# EAGLE design Top Falcon (EAGLE 9.6.2)
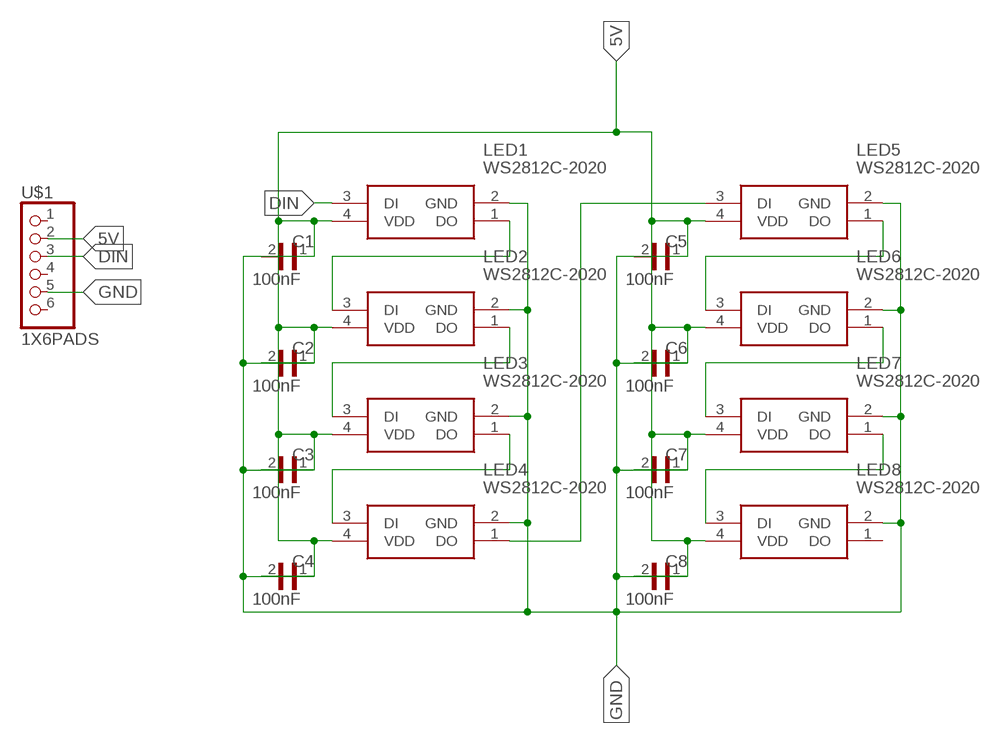
[diagram p0: schematic, sheet 1]

## Parts
C1  100nF  CC0402KRX7R5BB104  [CAPC1005X55N]
C2  100nF  CC0402KRX7R5BB104  [CAPC1005X55N]
C3  100nF  CC0402KRX7R5BB104  [CAPC1005X55N]
C4  100nF  CC0402KRX7R5BB104  [CAPC1005X55N]
C5  100nF  CC0402KRX7R5BB104  [CAPC1005X55N]
C6  100nF  CC0402KRX7R5BB104  [CAPC1005X55N]
C7  100nF  CC0402KRX7R5BB104  [CAPC1005X55N]
C8  100nF  CC0402KRX7R5BB104  [CAPC1005X55N]
LED1  WS2812C-2020  [WS2812C2020]
LED2  WS2812C-2020  [WS2812C2020]
LED3  WS2812C-2020  [WS2812C2020]
LED4  WS2812C-2020  [WS2812C2020]
LED5  WS2812C-2020  [WS2812C2020]
LED6  WS2812C-2020  [WS2812C2020]
LED7  WS2812C-2020  [WS2812C2020]
LED8  WS2812C-2020  [WS2812C2020]
U$1  1X6PADS  [1X6PADS]

## Nets
5V: C1.2 C2.2 C3.2 C4.2 C5.2 C6.2 C7.2 C8.2 LED1.4(VDD) LED2.4(VDD) LED3.4(VDD) LED4.4(VDD) LED5.4(VDD) LED6.4(VDD) LED7.4(VDD) LED8.4(VDD) U$1.2
DIN: LED1.3(DI) U$1.3
GND: C1.1 C2.1 C3.1 C4.1 C5.1 C6.1 C7.1 C8.1 LED1.2(GND) LED2.2(GND) LED3.2(GND) LED4.2(GND) LED5.2(GND) LED6.2(GND) LED7.2(GND) LED8.2(GND) U$1.5
N$1: LED1.1(DO) LED2.3(DI)
N$2: LED2.1(DO) LED3.3(DI)
N$3: LED3.1(DO) LED4.3(DI)
N$4: LED4.1(DO) LED5.3(DI)
N$5: LED5.1(DO) LED6.3(DI)
N$6: LED6.1(DO) LED7.3(DI)
N$7: LED7.1(DO) LED8.3(DI)
Unconnected: LED8.1(DO) U$1.1 U$1.4 U$1.6

## Library data of the parts
C1-C8 = CC0402KRX7R5BB104:CC0402KRX7R5BB104: CAP CER 0.1UF 6.3V X7R 0402; DESCRIPTION: 0.1µF ±10% 6.3V Ceramic Capacitor X7R 0402 (1005 Metric); DIGI-KEY_PART_NUMBER: 311-1701-1-ND; MF: Yageo; MP: CC0402KRX7R5BB104; PACKAGE: 0402 Yageo
LED1-LED8 = WS2812C-2020:WS2812C-2020: Intelligent control LED integrated light source Source: Datasheet <http://www.world-semi.com/DownLoadFile/139>; ARROW_PART_NUMBER: WS2812C-2020; DESCRIPTION: Intelligent control LED integrated light source; HEIGHT: 0.84mm; MANUFACTURER_NAME: Worldsemi; MANUFACTURER_PART_NUMBER: WS2812C-2020
U$1 = SMD Pads:1X6PADS

## Board
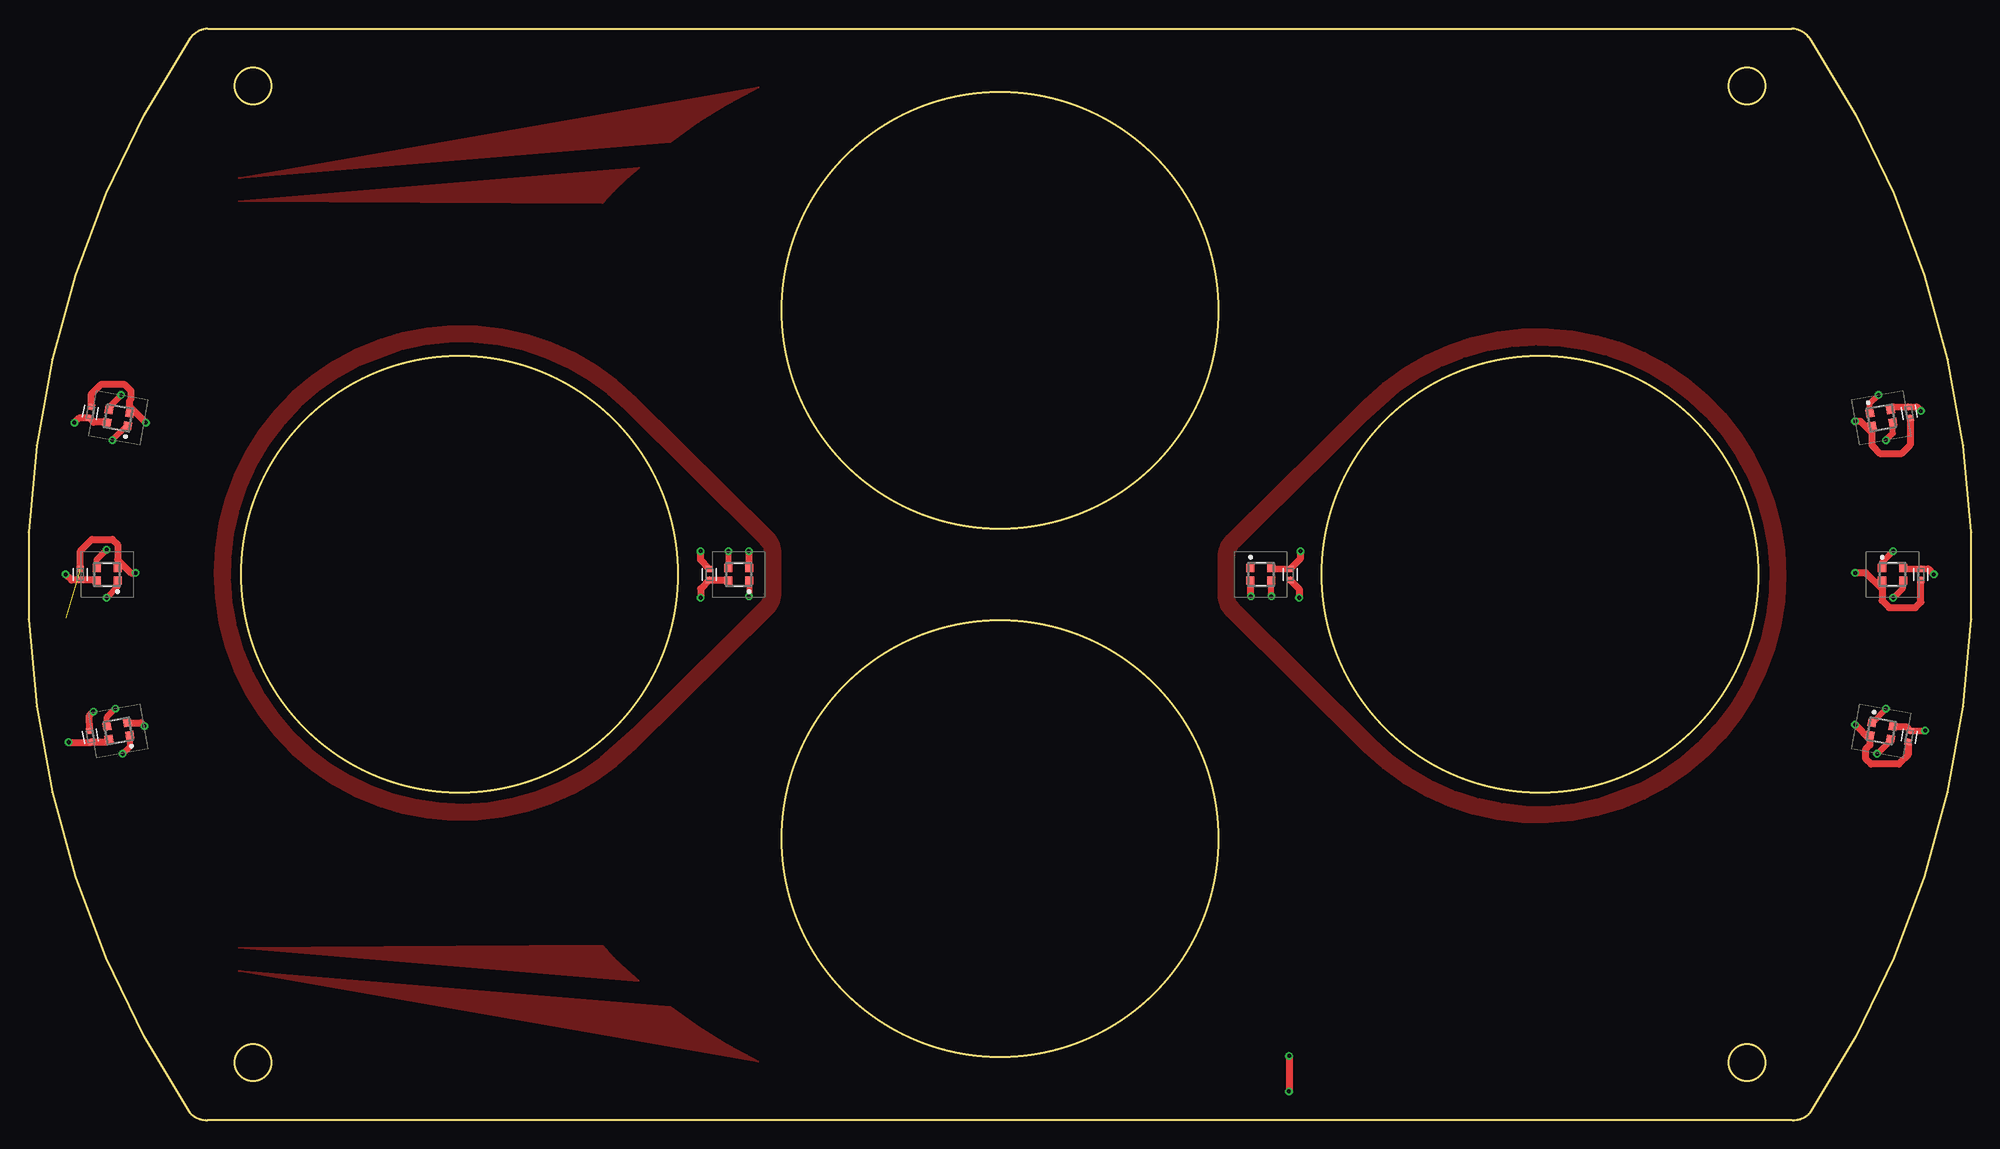
[diagram p1: board, top side]
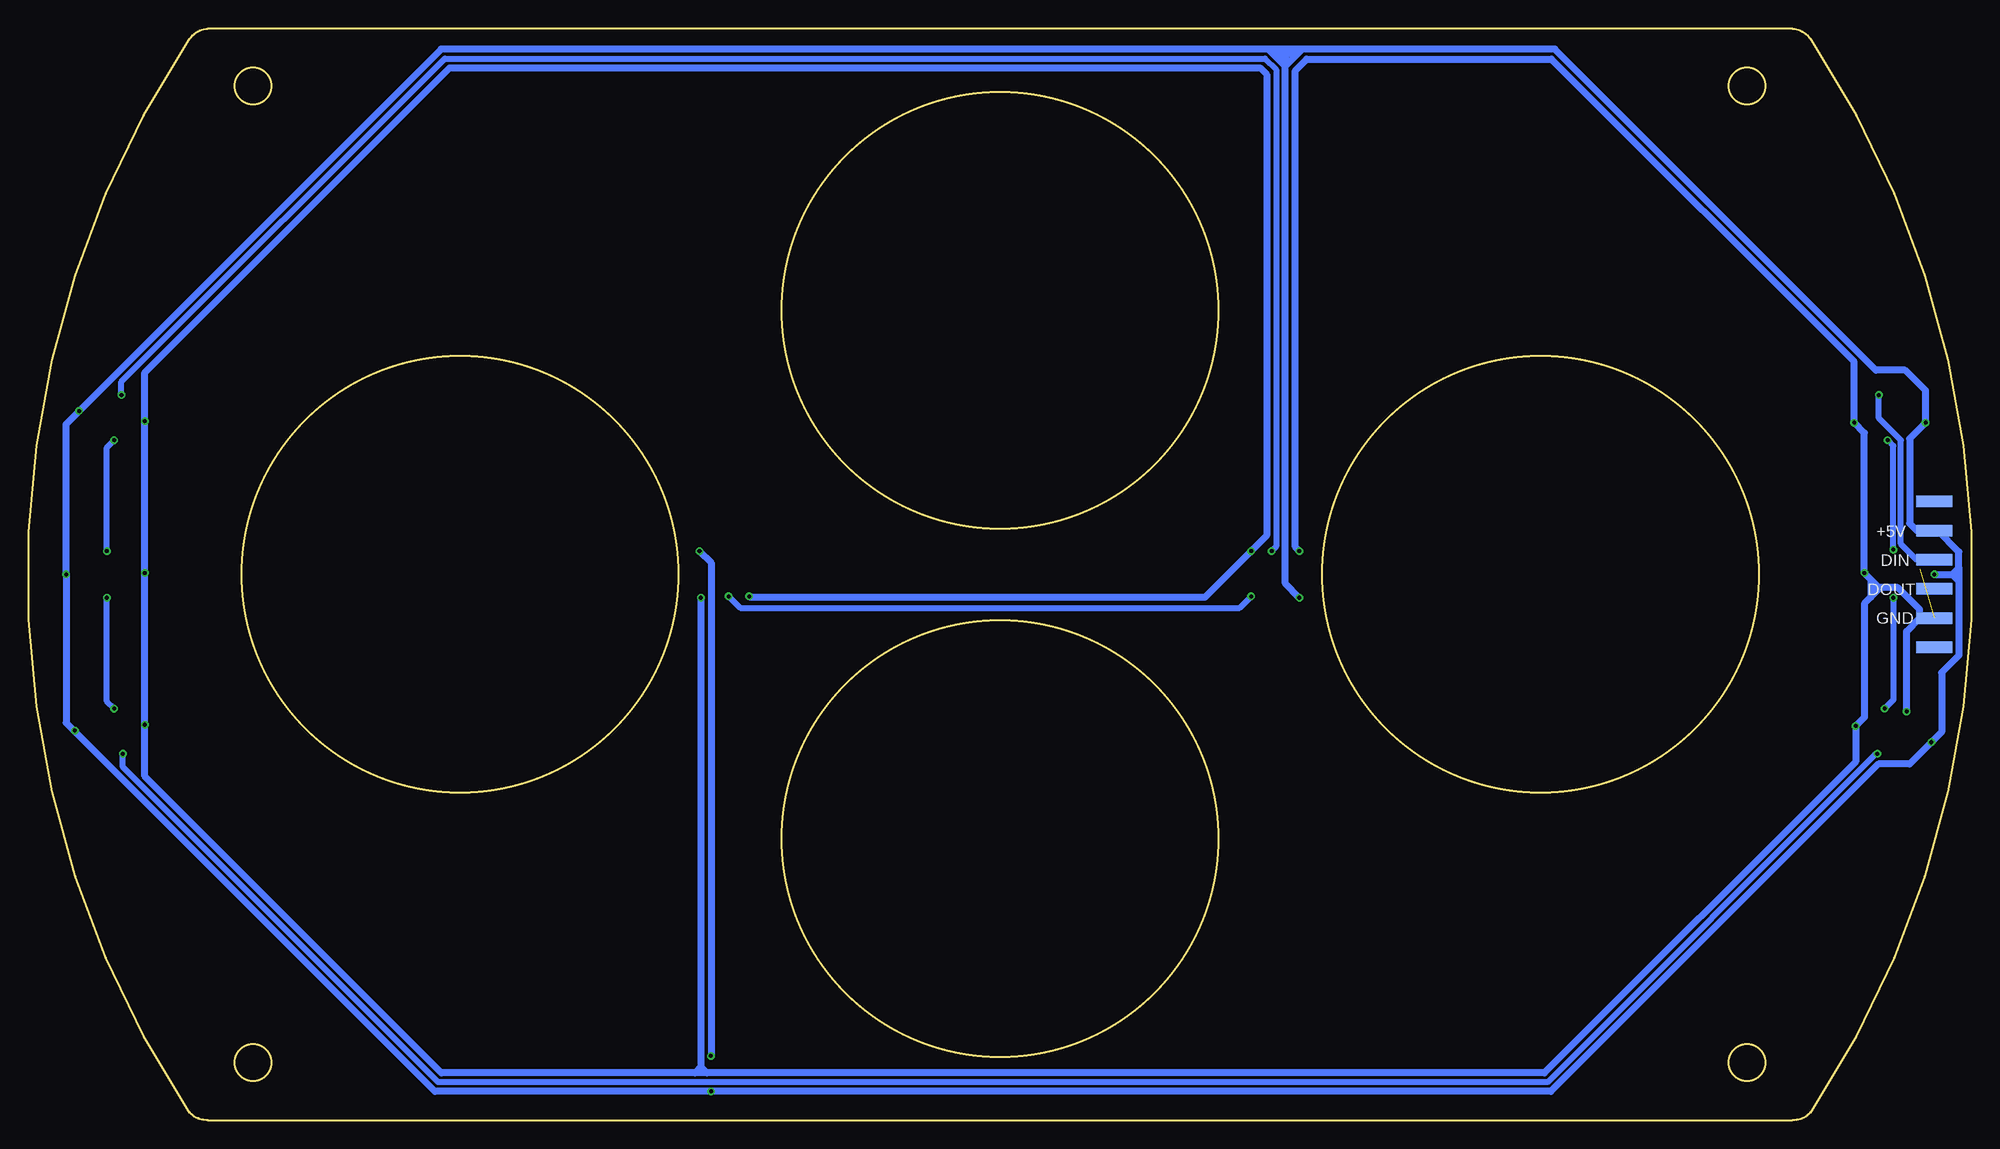
[diagram p2: board, bottom side, seen from below]

Size 169.02 x 95 mm. Coordinates in mm from the lower left corner, seen from the top.
Outline: 15.56,95 153.42,95 arc-57 155.11,93.98 arc-67 155.11,0.78 arc-57 153.42,0 15.56,0 arc-57 13.91,0.78 arc-67 13.91,93.98 arc-57 15.56,95
Outline: circle at 131.49,47.5 radius 19
Outline: circle at 84.49,70.5 radius 19
Outline: circle at 84.49,24.5 radius 19
Outline: circle at 37.49,47.5 radius 19
Outline: circle at 149.49,90 radius 1.6
Outline: circle at 19.49,90 radius 1.6
Outline: circle at 149.49,5 radius 1.6
Outline: circle at 19.49,5 radius 1.6
Copper layers (1*16): Top 0.035mm / dielectric 1.5mm / Bottom 0.035mm
Design rules "default *": minimum track width 5mil, minimum drill 0.3mm, track to track 5mil, track to pad 0.229mm, pad to pad 0.229mm, via to via 0.229mm, smd to smd 5mil, copper to edge 0.5mm, drill to drill 0.5mm, minimum pad ring 0.15mm, minimum via ring 0.15mm, stop-mask expansion 4mil, vias tented up to drill 0.35mm, thermal gap 10mil

### Footprints (pad centres in the part's own frame; a part is rotated, then mirrored left to right if it is on the bottom)
CAPC1005X55N = smd 0.527 x 0.6: 1 -0.486,0; 2 0.486,0
WS2812C2020 = smd 0.7 x 0.7: 1 0.915,-0.55; 2 0.915,0.55; 3 -0.915,0.55; 4 -0.915,-0.55
1X6PADS = smd 3.135 x 1: 1 0,6.35; 2 0,3.81; 3 0,1.27; 4 0,-1.27; 5 0,-3.81; 6 0,-6.35

### Placement (x,y rotation side)
C1  5.37,61.6 260 top
C2  4.48,47.5 270 top
C3  5.37,33.41 280 top
C4  163.61,33.41 80 top
C5  164.63,47.5 90 top
C6  163.61,61.6 100 top
C7  59.22,47.5 270 top
C8  109.77,47.5 90 top
LED1  7.79,61.13 350 top
LED2  6.82,47.5 0 top
LED3  7.79,33.88 10 top
LED4  161.19,33.88 170 top
LED5  162.17,47.5 180 top
LED6  161.19,61.13 190 top
LED7  61.78,47.5 0 top
LED8  107.21,47.5 180 top
U$1  3.21,47.5 0 bottom

### Tracks (layer width: path | path; a pad name or v marks a point on that pad's centre or on a via)
5V  (via drill 0.35)
  Top 0.61: LED1.4 5.64,60.74 C1.2 4.36,61.1 v3.98,60.71 | LED2.4 5.86,47 C2.2 3.72,47 v3.21,47.5 | LED3.4 6.72,32.91 C3.2 5.45,32.9 v3.47,32.9 | LED4.4 163.35,34.26 C4.2 v165,33.91 v165.01,33.91 | LED5.4 163.12,48.01 C5.2 165.27,48.01 v165.77,47.5 | LED6.4 162.27,62.1 C6.2 164.26,62.1 v164.63,61.73 | LED8.4 108.17,48.01 C8.2 110.66,48.9 v110.66,49.54 | LED7.4 60.82,47 C7.2 58.46,46.23 v58.46,45.47 | v109.67,5.59 109.67,2.52 v109.64,2.49
  Bottom 0.61: 1.09,48.08 1.66,47.5 | v3.21,47.5 1.66,47.5 | 1.09,48.08 1.09,49.47 2.93,51.31 U$1.2 4.74,51.31 5.37,51.95 5.37,59.31 v3.98,60.71 3.98,63.51 5.75,65.28 8.29,65.28 36.23,93.22 58.2,93.22 | 1.09,48.08 1.09,46.93 | 1.09,46.93 1.09,40.46 2.58,38.97 2.58,33.79 v3.47,32.9 5.37,30.99 8.09,30.99 36.58,2.49 v109.64,2.49 133.67,2.49 165.01,33.83 | 1.66,47.5 1.09,46.93 | 165.01,33.83 v165.01,33.91 | 165.01,33.83 165.77,34.6 v165.77,47.5 165.77,60.58 v164.63,61.73 133.13,93.22 61.17,93.22 | 58.2,93.22 61.17,93.22 | 58.2,93.22 58.65,92.78 | 58.65,92.78 59.35,92.08 | 59.35,92.08 59.68,91.75 59.68,91.73 | 61.17,93.22 60.77,92.82 | 59.68,91.73 60.77,92.82 | 58.65,92.78 58.69,92.82 60.09,92.82 | 60.77,92.82 60.09,92.82 | 60.09,92.82 59.35,92.08 | v58.46,45.47 59.68,46.69 59.68,91.73 | v110.66,49.54 109.64,48.52 109.64,5.62 v109.67,5.59
DIN  (via drill 0.35)
  Top 0.508: v8.04,63.12 6.99,62.07 LED1.3
  Bottom 0.508: v8.04,63.12 8.04,61.09 6.13,59.19 6.13,50.17 4.74,48.77 U$1.3
GND  (via drill 0.35)  (1 unrouted)
  Top 0.61: C3.1 5.28,35.22 v5.63,35.57 | C1.1 5.46,63.21 6.26,64.01 8.37,64.01 8.9,63.48 8.9,62.77 8.79,62.66 8.79,62.12 | 8.79,62.12 LED1.2 | v10.2,60.71 8.79,62.12 | LED3.2 9.79,34.58 v10.07,34.3 | LED4.2 160.2,33.14 | C4.1 163.53,31.79 162.73,30.99 160.31,30.99 159.8,31.5 159.8,32.26 160.2,32.66 160.2,33.14 | v158.92,34.42 160.2,33.14 | LED5.2 161.25,46.23 | 161.25,46.23 161.25,45.22 161.86,44.61 164.15,44.61 164.63,45.09 C5.1 | 161.25,46.23 159.85,47.63 v158.92,47.63 | C6.1 163.7,58.77 162.98,58.04 161.07,58.04 160.39,58.73 160.39,59.82 | 160.39,59.82 LED6.2 | v158.92,60.84 159.37,60.84 160.39,59.82 | LED7.2 62.69,49.49 v62.65,49.54 | LED8.2 106.3,45.64 v106.34,45.6 | C8.1 110.53,46.23 v110.53,45.47 | C7.1 58.46,48.77 v58.46,49.54 | C2.1 4.48,49.54 5.5,50.55 7.28,50.55 7.74,50.09 7.74,48.77 | 7.74,48.77 LED2.2 | 7.74,48.77 8.88,47.63 v9.31,47.63
  Bottom 0.61: 8.74,47.06 v9.31,47.63 9.31,59.82 v10.2,60.71 10.2,66.02 36.54,92.36 57.82,92.36 58.81,91.37 58.81,49.89 v58.46,49.54 | 8.74,47.06 8.1,46.42 | 8.1,46.42 8.04,46.36 | 8.04,46.36 6.39,46.36 4.48,44.46 4.48,43.69 5.63,42.55 v5.63,35.57 | 8.04,46.36 8.04,46.23 8.74,45.54 | 8.74,45.54 9.31,44.96 9.31,35.06 v10.07,34.3 10.07,31.2 37.15,4.12 110.02,4.12 | 8.74,47.06 8.74,46.23 | 8.74,46.23 8.74,45.54 | 8.74,46.23 8.29,46.23 8.1,46.42 | 110.02,4.12 111.04,4.12 | 111.04,4.12 133.1,4.12 158.92,29.93 v158.92,34.42 v158.92,47.63 v158.92,60.84 158.92,65.08 132.39,91.6 61.87,91.6 61.3,91.03 61.3,50.88 v62.65,49.54 66.66,45.52 106.26,45.52 v106.34,45.6 | v110.53,45.47 110.53,4.63 | 110.53,4.63 110.02,4.12 | 110.53,4.63 111.04,4.12
N$1  (via drill 0.35)
  Top 0.508: LED2.3 5.91,48.8 v6.77,49.66 | v7.28,59.19 8.52,60.43 LED1.1
  Bottom 0.508: v6.77,49.66 6.77,58.68 v7.28,59.19
N$2  (via drill 0.35)
  Top 0.508: LED2.1 7.74,46.44 v6.77,45.47 | LED3.3 6.8,35.08 v7.53,35.82
  Bottom 0.508: v6.77,45.47 6.77,36.58 v7.53,35.82
N$3  (via drill 0.35)
  Top 0.508: LED3.1 8.79,32.51 v8.17,31.88 | v160.82,31.88 162,33.06 LED4.3
  Bottom 0.508: v8.17,31.88 8.29,31.88 36.87,3.31 133.39,3.31 160.82,30.74 v160.82,31.88
N$4  (via drill 0.35)
  Top 0.508: LED4.1 161.58,35.77 v161.58,35.82 | v162.22,45.47 163.08,46.34 LED5.3
  Bottom 0.508: v161.58,35.82 162.22,36.45 v162.22,45.47
N$5  (via drill 0.35)
  Top 0.508: LED5.1 161.25,48.57 v162.22,49.54 | v161.58,59.19 162.19,59.8 LED6.3
  Bottom 0.508: v162.22,49.54 162.22,58.55 v161.58,59.19
N$6  (via drill 0.35)
  Top 0.508: LED6.1 160.2,62.37 v160.95,63.12 | v60.87,49.54 LED7.3
  Bottom 0.508: v160.95,63.12 160.95,64.27 132.8,92.41 61.46,92.41 60.49,91.45 60.49,49.92 v60.87,49.54
N$7  (via drill 0.35)
  Top 0.508: LED7.1 62.69,45.64 v62.65,45.6 | v108.12,45.6 LED8.3
  Bottom 0.508: v108.12,45.6 107.1,44.58 63.67,44.58 v62.65,45.6
N$9
  pour Top: 49.9,79.8 18.24,80 53.1,82.91 arc11
N$13
  pour Top: 55.81,85.14 18.24,82 63.5,89.92 arc11
N$53
  pour Top: 52.78,62.9 arc269 52.78,32.35 64.7,44.17 arc45 65.44,45.94 65.44,49.31 arc45 64.7,51.08
N$54
  cutout Top: 17.69,49.02 17.65,47.04 17.82,45.05 18.19,43.04 18.77,41.04 19.56,39.08 20.57,37.21 21.78,35.46 23.16,33.85 24.69,32.4 26.33,31.13 28.06,30.07 29.85,29.21 31.71,28.53 33.68,28.03 35.73,27.72 37.83,27.63 39.94,27.76 42.04,28.12 44.09,28.7 46.05,29.49 47.9,30.46 49.6,31.59 52.6,34.29 55.54,37.2 61.43,43.03 62.9,44.49 63.64,45.22 63.9,45.66 63.94,46.17 63.94,49.28 63.82,49.78 63.49,50.17 51.72,61.83 50.24,63.16 48.6,64.35 46.81,65.4 44.9,66.26 42.88,66.93 40.8,67.37 38.68,67.59 36.57,67.59 34.49,67.38 32.5,66.95 28.78,65.55 27.02,64.57 25.34,63.38 23.76,62.01 22.31,60.47 21.04,58.76 19.95,56.93 19.06,55.01 18.39,53.02 17.93,51.01
N$74
  pour Top: 53.1,12.09 18.24,15 49.9,15.21 arc11
N$77
  pour Top: 63.5,5.09 18.24,13 55.81,9.87 arc11
N$89
  pour Top: 104.28,43.92 arc-45 103.54,45.7 103.54,49.06 arc-45 104.28,50.84 116.21,62.66 arc-269 116.21,32.11
N$90
  cutout Top: 105.16,45.23 105.04,45.73 105.04,48.83 105.09,49.35 105.35,49.79 106.09,50.52 107.56,51.97 113.45,57.8 116.39,60.72 119.39,63.41 121.09,64.55 122.94,65.52 124.9,66.31 126.95,66.89 129.04,67.25 131.16,67.38 133.26,67.28 135.31,66.98 137.28,66.48 139.14,65.8 140.93,64.94 142.66,63.87 144.3,62.61 145.83,61.16 147.21,59.55 148.42,57.79 149.43,55.92 150.22,53.97 150.8,51.97 151.17,49.96 151.33,47.97 151.29,45.99 151.05,43.99 150.6,41.98 149.93,40 149.04,38.07 147.95,36.24 146.67,34.54 145.23,33 143.65,31.62 141.96,30.44 140.21,29.45 136.49,28.05 134.49,27.63 132.42,27.42 130.31,27.42 128.19,27.64 126.11,28.08 124.09,28.74 122.18,29.61 120.39,30.65 118.75,31.85 117.27,33.17 105.49,44.84

### Text on the board
bPlace: +5V | DIN | DOUT | GND